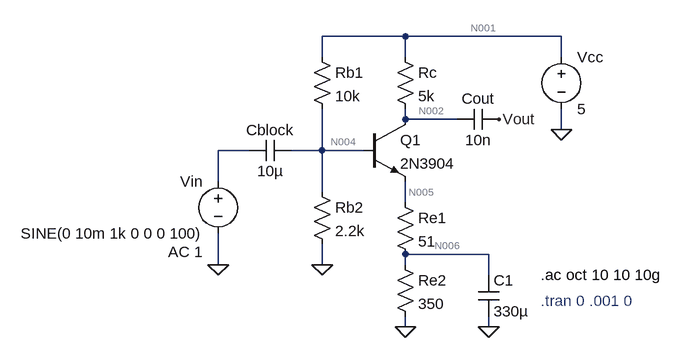
[diagram p0: schematic sim.asc]
sim.asc, the LTspice schematic file:
Version 4
SHEET 1 880 680
WIRE 304 -16 176 -16
WIRE 544 -16 304 -16
WIRE 176 16 176 -16
WIRE 304 16 304 -16
WIRE 544 16 544 -16
WIRE 304 112 304 96
WIRE 384 112 304 112
WIRE 544 128 544 96
WIRE 64 160 16 160
WIRE 176 160 176 96
WIRE 176 160 128 160
WIRE 240 160 176 160
WIRE 16 208 16 160
WIRE 176 224 176 160
WIRE 304 240 304 208
WIRE 432 320 304 320
WIRE 16 336 16 288
WIRE 176 336 176 304
WIRE 304 336 304 320
WIRE 432 352 432 320
WIRE 304 432 304 416
WIRE 432 432 432 416
FLAG 176 336 0
FLAG 16 336 0
FLAG 544 128 0
FLAG 448 112 Vout
FLAG 304 432 0
FLAG 432 432 0
SYMBOL res 160 0 R0
SYMATTR InstName Rb1
SYMATTR Value 10k
SYMBOL res 160 208 R0
SYMATTR InstName Rb2
SYMATTR Value 2.2k
SYMBOL cap 64 144 M90
WINDOW 0 0 32 VBottom 2
WINDOW 3 32 32 VTop 2
SYMATTR InstName Cblock
SYMATTR Value 10µ
SYMBOL npn 240 112 R0
SYMATTR InstName Q1
SYMATTR Value 2N3904
SYMBOL res 288 0 R0
SYMATTR InstName Rc
SYMATTR Value 5k
SYMBOL voltage 16 192 M0
WINDOW 123 24 124 Left 2
WINDOW 39 0 0 Left 2
SYMATTR Value2 AC 1
SYMATTR InstName Vin
SYMATTR Value SINE(0 10m 1k 0 0 0 100)
SYMBOL voltage 544 0 R0
SYMATTR InstName Vcc
SYMATTR Value 5
SYMBOL cap 384 96 M90
WINDOW 0 0 32 VBottom 2
WINDOW 3 32 32 VTop 2
SYMATTR InstName Cout
SYMATTR Value 10n
SYMBOL res 288 224 R0
SYMATTR InstName Re1
SYMATTR Value 51
SYMBOL res 288 320 R0
SYMATTR InstName Re2
SYMATTR Value 350
SYMBOL cap 416 352 R0
SYMATTR InstName C1
SYMATTR Value 330µ
TEXT 512 392 Left 2 ;.tran 0 .001 0
TEXT 512 352 Left 2 !.ac oct 10 10 10g

The netlist it stands for:
* sim.asc
Rb1 N001 N004 10k
Rb2 N004 0 2.2k
Cblock N003 N004 10µ
Q1 N002 N004 N005 0 2N3904
Rc N001 N002 5k
Vin N003 0 SINE(0 10m 1k 0 0 0 100) AC 1
Vcc N001 0 5
Cout N002 Vout 10n
Re1 N005 N006 51
Re2 N006 0 350
C1 N006 0 330µ
.model NPN NPN
.model PNP PNP
.lib standard.bjt
* .tran 0 .001 0
.ac oct 10 10 10g
.backanno
.end

* Results of the author's LTspice run, read from the files saved beside the schematic
* Operating Point, zero values left out:
*   V(n001) = 5 V
*   V(n004) = 897.9 mV
*   V(n002) = 1.835 V
*   V(n005) = 254.7 mV
*   V(vout) = 18.35 nV
*   V(n006) = 222.3 mV
*   Ic(Q1) = 633 µA
*   Ib(Q1) = 2.094 µA
*   Ie(Q1) = -635.1 µA
*   I(Re2) = 635.1 µA
*   I(Re1) = 635.1 µA
*   I(Rc) = 633 µA
*   I(Rb2) = 408.1 µA
*   I(Rb1) = 410.2 µA
*   I(Vcc) = -1.043 mA
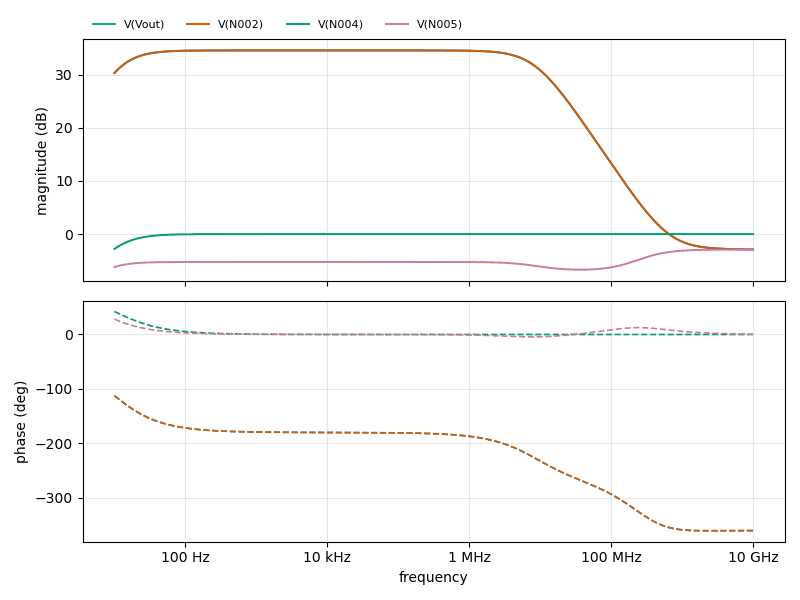
[diagram p1: AC Analysis of sim.asc, plotted from the saved traces]
* AC Analysis, 1 run:
*   V(Vout): 30.30 dB at 10 Hz, -2.88 dB at 10 GHz, peak 34.56 dB at 10.24 kHz, 3 dB below the peak at 12.48 Hz and 8.579 MHz
*   V(N002): 30.30 dB at 10 Hz, -2.88 dB at 10 GHz, peak 34.56 dB at 10.24 kHz, 3 dB below the peak at 12.48 Hz and 8.579 MHz
*   V(N004): -2.79 dB at 10 Hz, -0.00 dB at 10 GHz, peak -0.00 dB at 10 GHz
*   V(N005): -6.21 dB at 10 Hz, -2.91 dB at 10 GHz, peak -2.91 dB at 10 GHz, 3 dB below the peak at 131.5 MHz